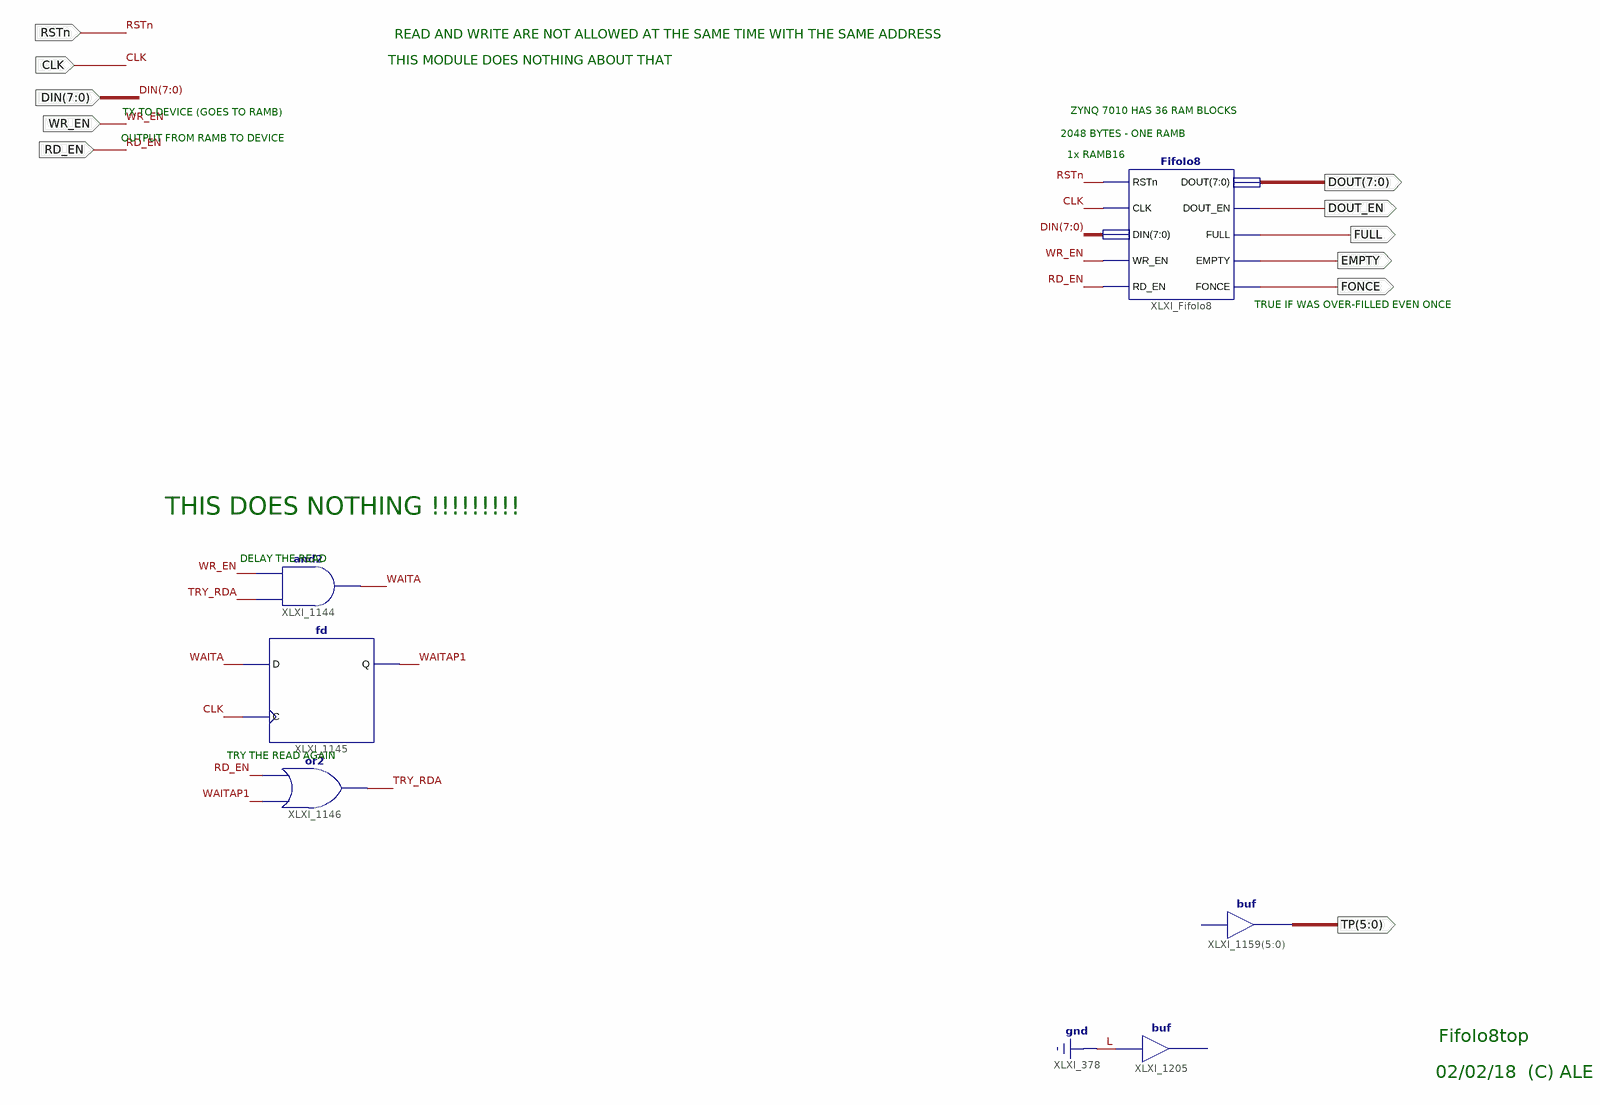
[diagram p0: schematic sheet 1]
// Xilinx ISE schematic FifoIo8top.sch (spartan3e) as structural Verilog: 6 symbols, 11 ports
module FifoIo8top (
  input  CLK,
  input  RSTn,
  input  [7:0] DIN,
  input  WR_EN,
  input  RD_EN,
  output [5:0] TP,
  output [7:0] DOUT,
  output DOUT_EN,
  output FULL,
  output EMPTY,
  output FONCE
);

  wire TRY_RDA, WAITA, WAITAP1;

  // buf XLXI_1159[5..0] has open pins: I=open, O=TP
  // buf XLXI_1205 has open pins: I=1'b0, O=open
  FifoIo8 XLXI_FifoIo8 (
    .CLK(CLK), .DIN(DIN), .DOUT(DOUT), .DOUT_EN(DOUT_EN), .EMPTY(EMPTY), .FONCE(FONCE), .FULL(FULL),
    .RD_EN(RD_EN), .RSTn(RSTn), .WR_EN(WR_EN));
  or XLXI_1146 (TRY_RDA, WAITAP1, RD_EN);
  fd XLXI_1145 (.C(CLK), .D(WAITA), .Q(WAITAP1));
  and XLXI_1144 (WAITA, TRY_RDA, WR_EN);

  // Notes on the sheet:
  //   READ AND WRITE ARE NOT ALLOWED AT THE SAME TIME WITH THE SAME ADDRESS
  //   THIS MODULE DOES NOTHING ABOUT THAT
  //   ZYNQ 7010 HAS 36 RAM BLOCKS
  //   TX TO DEVICE (GOES TO RAMB)
  //   2048 BYTES - ONE RAMB
  //   OUTPUT FROM RAMB TO DEVICE
  //   1x RAMB16
  //   TRUE IF WAS OVER-FILLED EVEN ONCE
  //   THIS DOES NOTHING !!!!!!!!!
  //   DELAY THE READ
  //   TRY THE READ AGAIN
  //   FifoIo8top
  //   02/02/18  (C) ALE
endmodule
